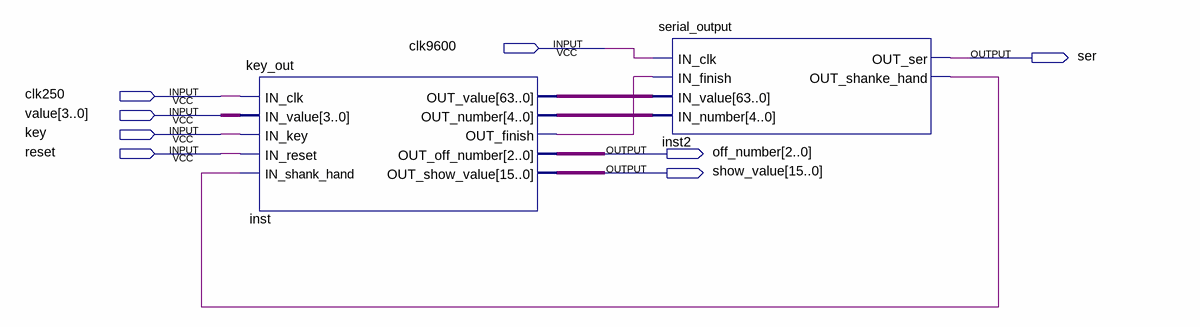
[diagram p0: schematic sheet]
// Quartus schematic test1.bdf as structural Verilog: 2 symbols, 8 pins
module test1 (
  input  clk9600,
  input  clk250,
  input  [3:0] value,
  input  key,
  input  reset,
  output ser,
  output [2:0] off_number,
  output [15:0] show_value
);

  wire inst2_out_shanke_hand, inst_out_finish;
  wire [4:0] inst_out_number;
  wire [63:0] inst_out_value;

  key_out inst (
    .IN_clk(clk250), .IN_value(value), .IN_key(key), .IN_reset(reset), .IN_shank_hand(inst2_out_shanke_hand),
    .OUT_value(inst_out_value), .OUT_number(inst_out_number), .OUT_finish(inst_out_finish),
    .OUT_off_number(off_number), .OUT_show_value(show_value));
  serial_output inst2 (
    .IN_clk(clk9600), .IN_finish(inst_out_finish), .IN_value(inst_out_value), .IN_number(inst_out_number),
    .OUT_ser(ser), .OUT_shanke_hand(inst2_out_shanke_hand));
endmodule
